# Altium schematic sheet 02_Face_InMain1V0.SchDoc
size A0
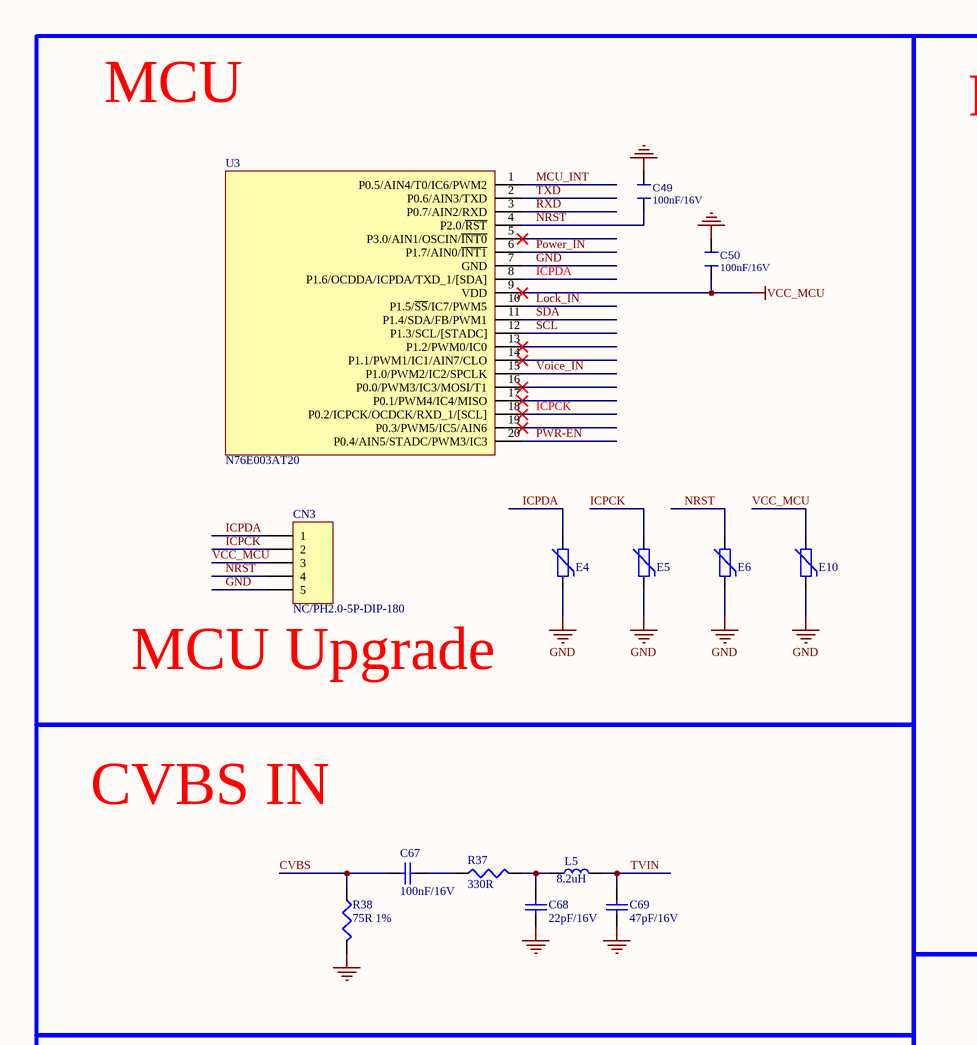
[diagram p0: 02_Face_InMain1V0.SchDoc, top left]
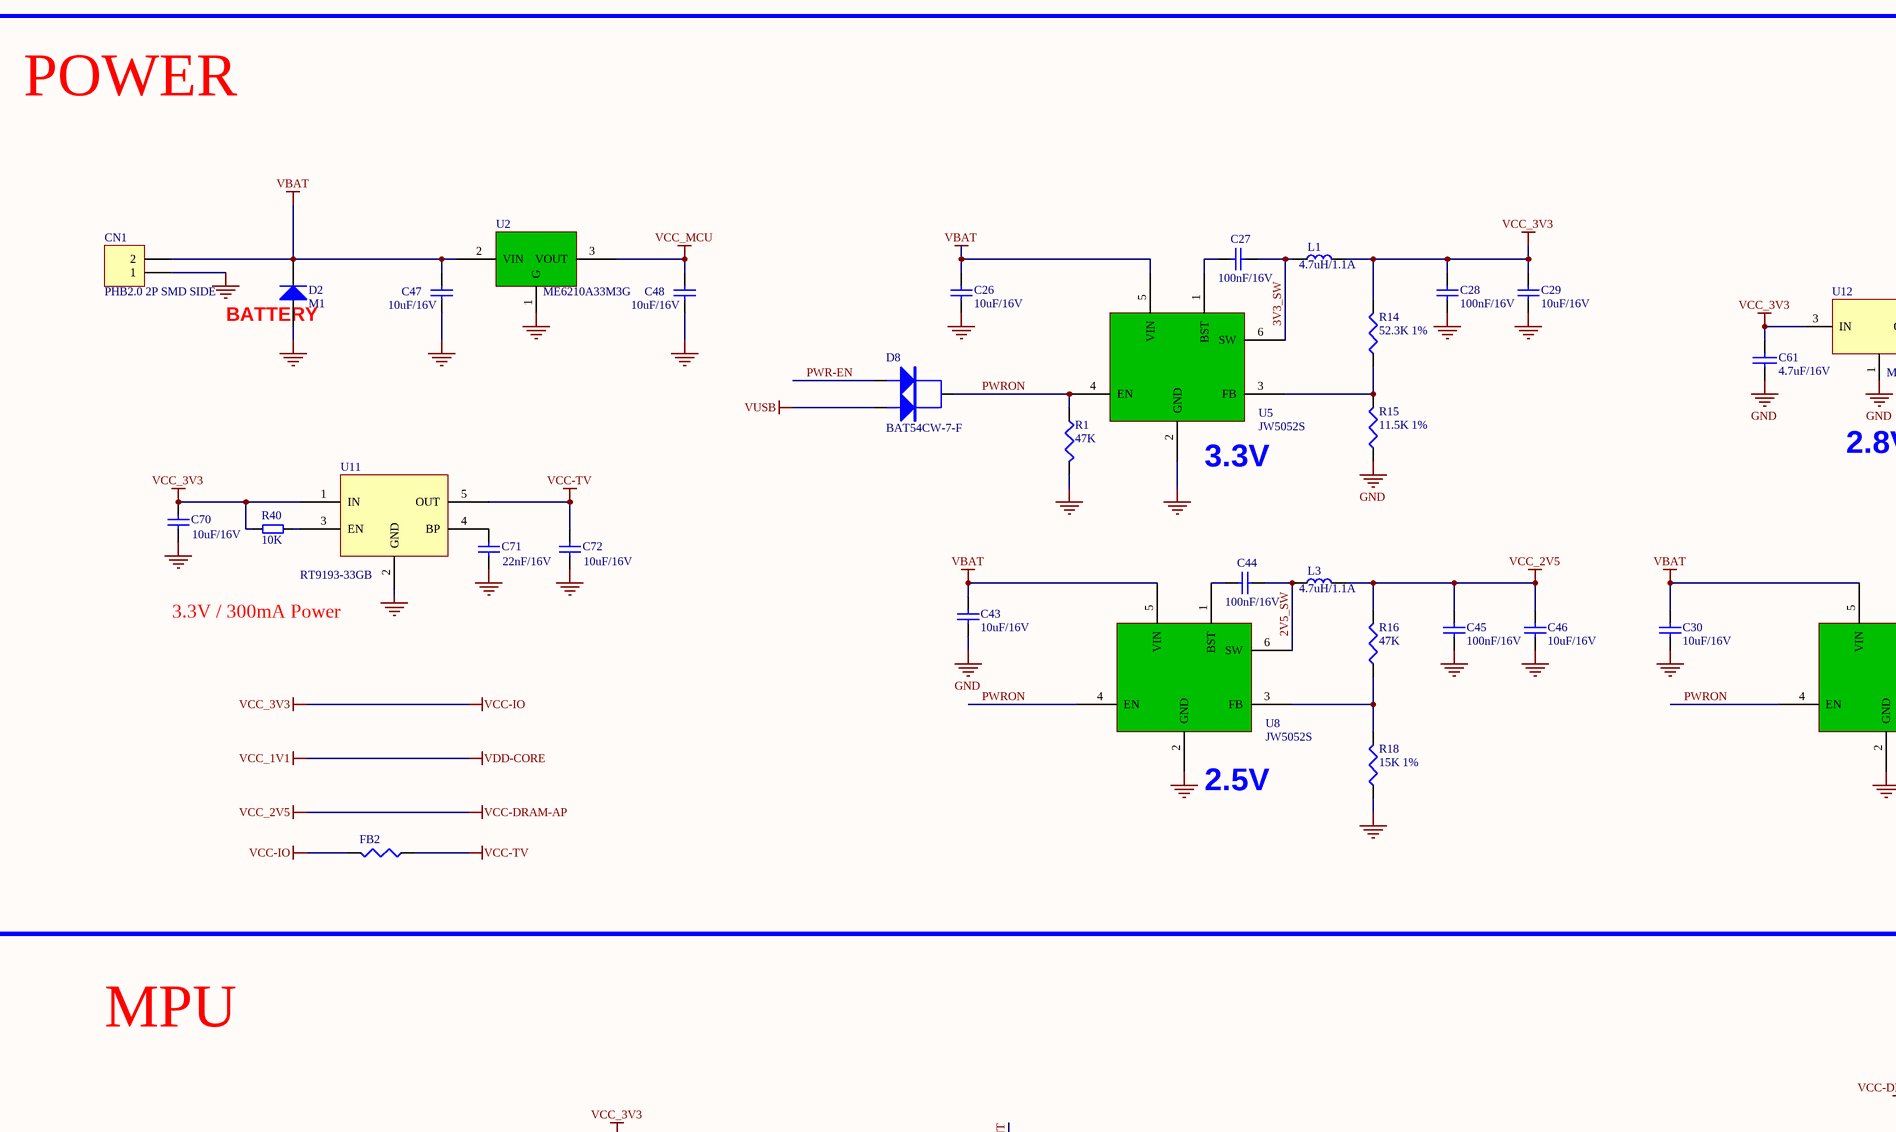
[diagram p1: 02_Face_InMain1V0.SchDoc, top middle]
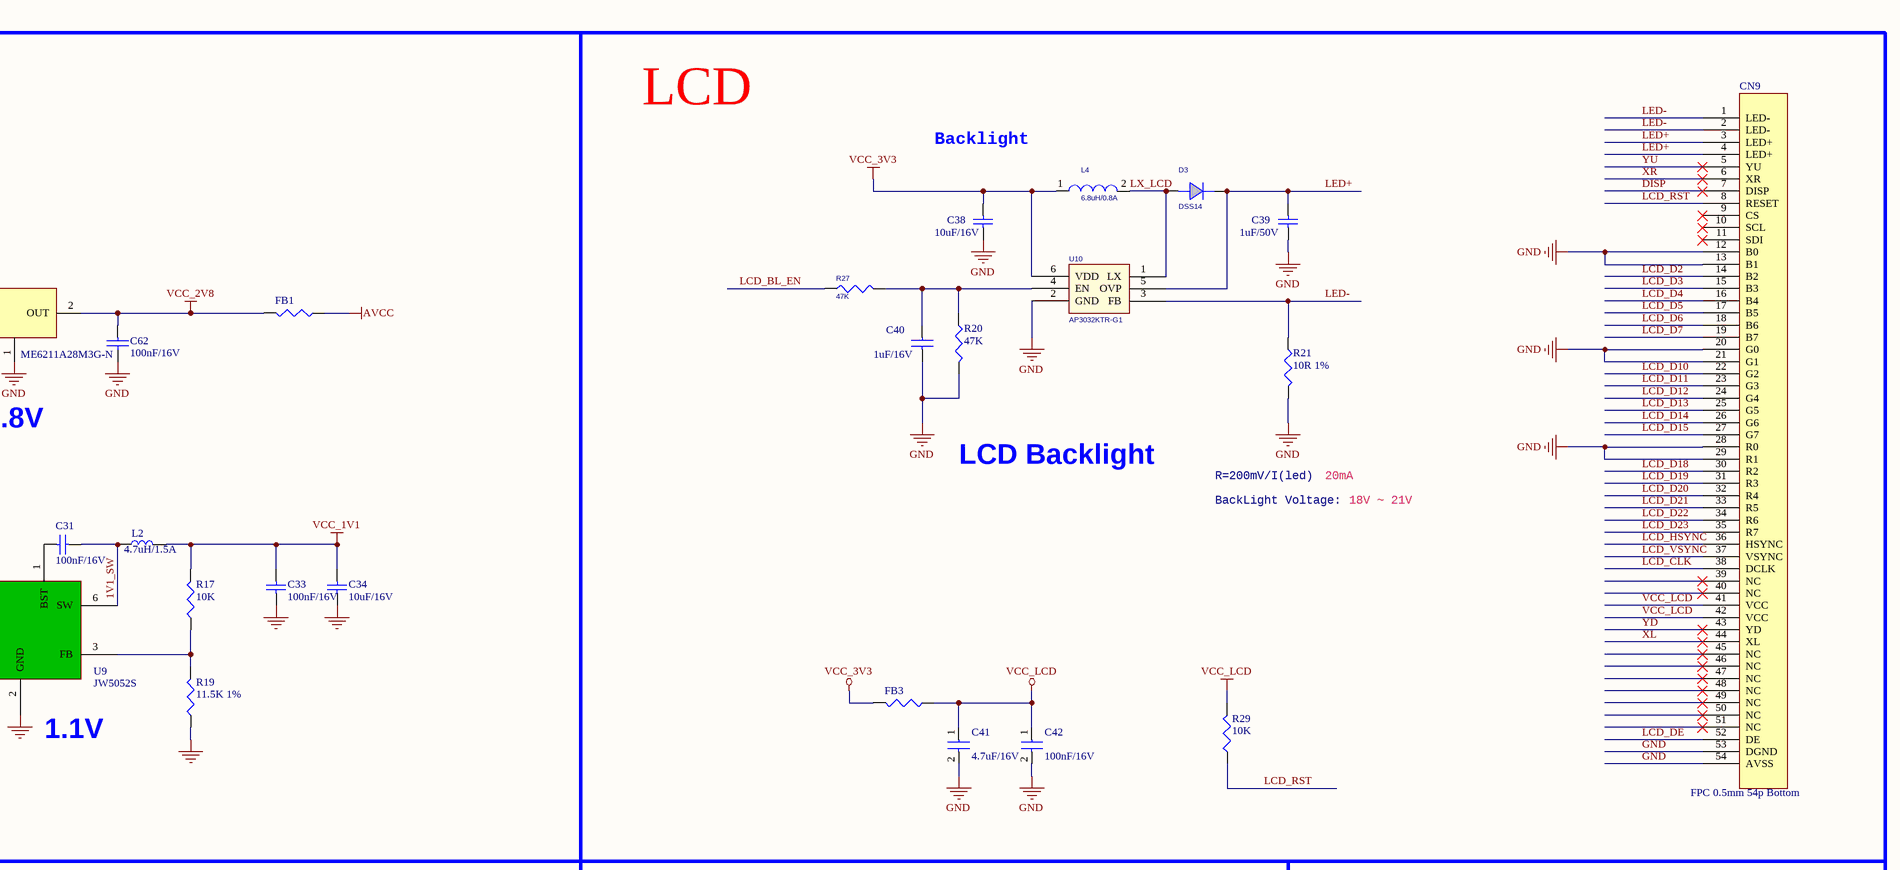
[diagram p2: 02_Face_InMain1V0.SchDoc, top right]
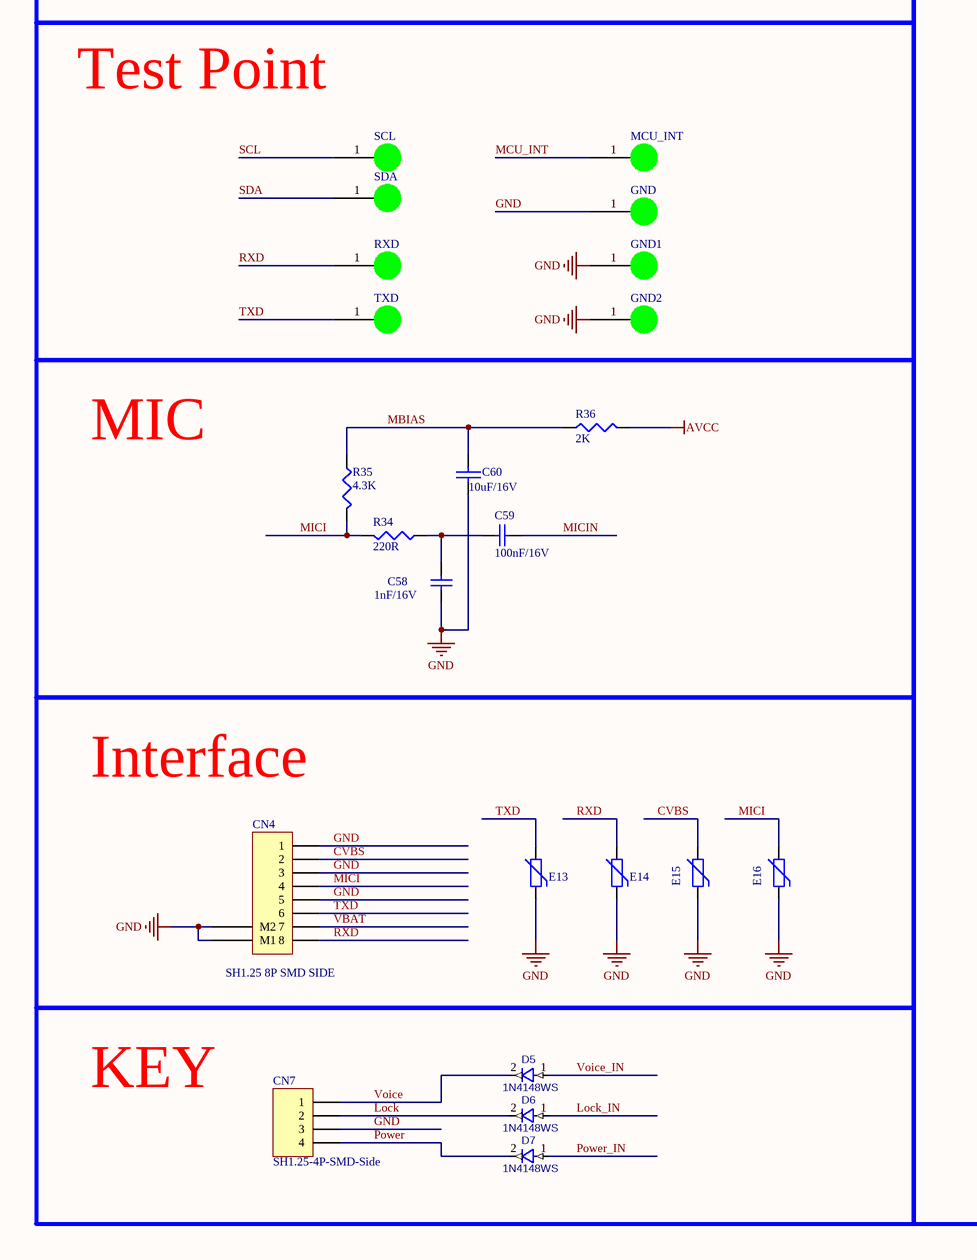
[diagram p3: 02_Face_InMain1V0.SchDoc, bottom left]
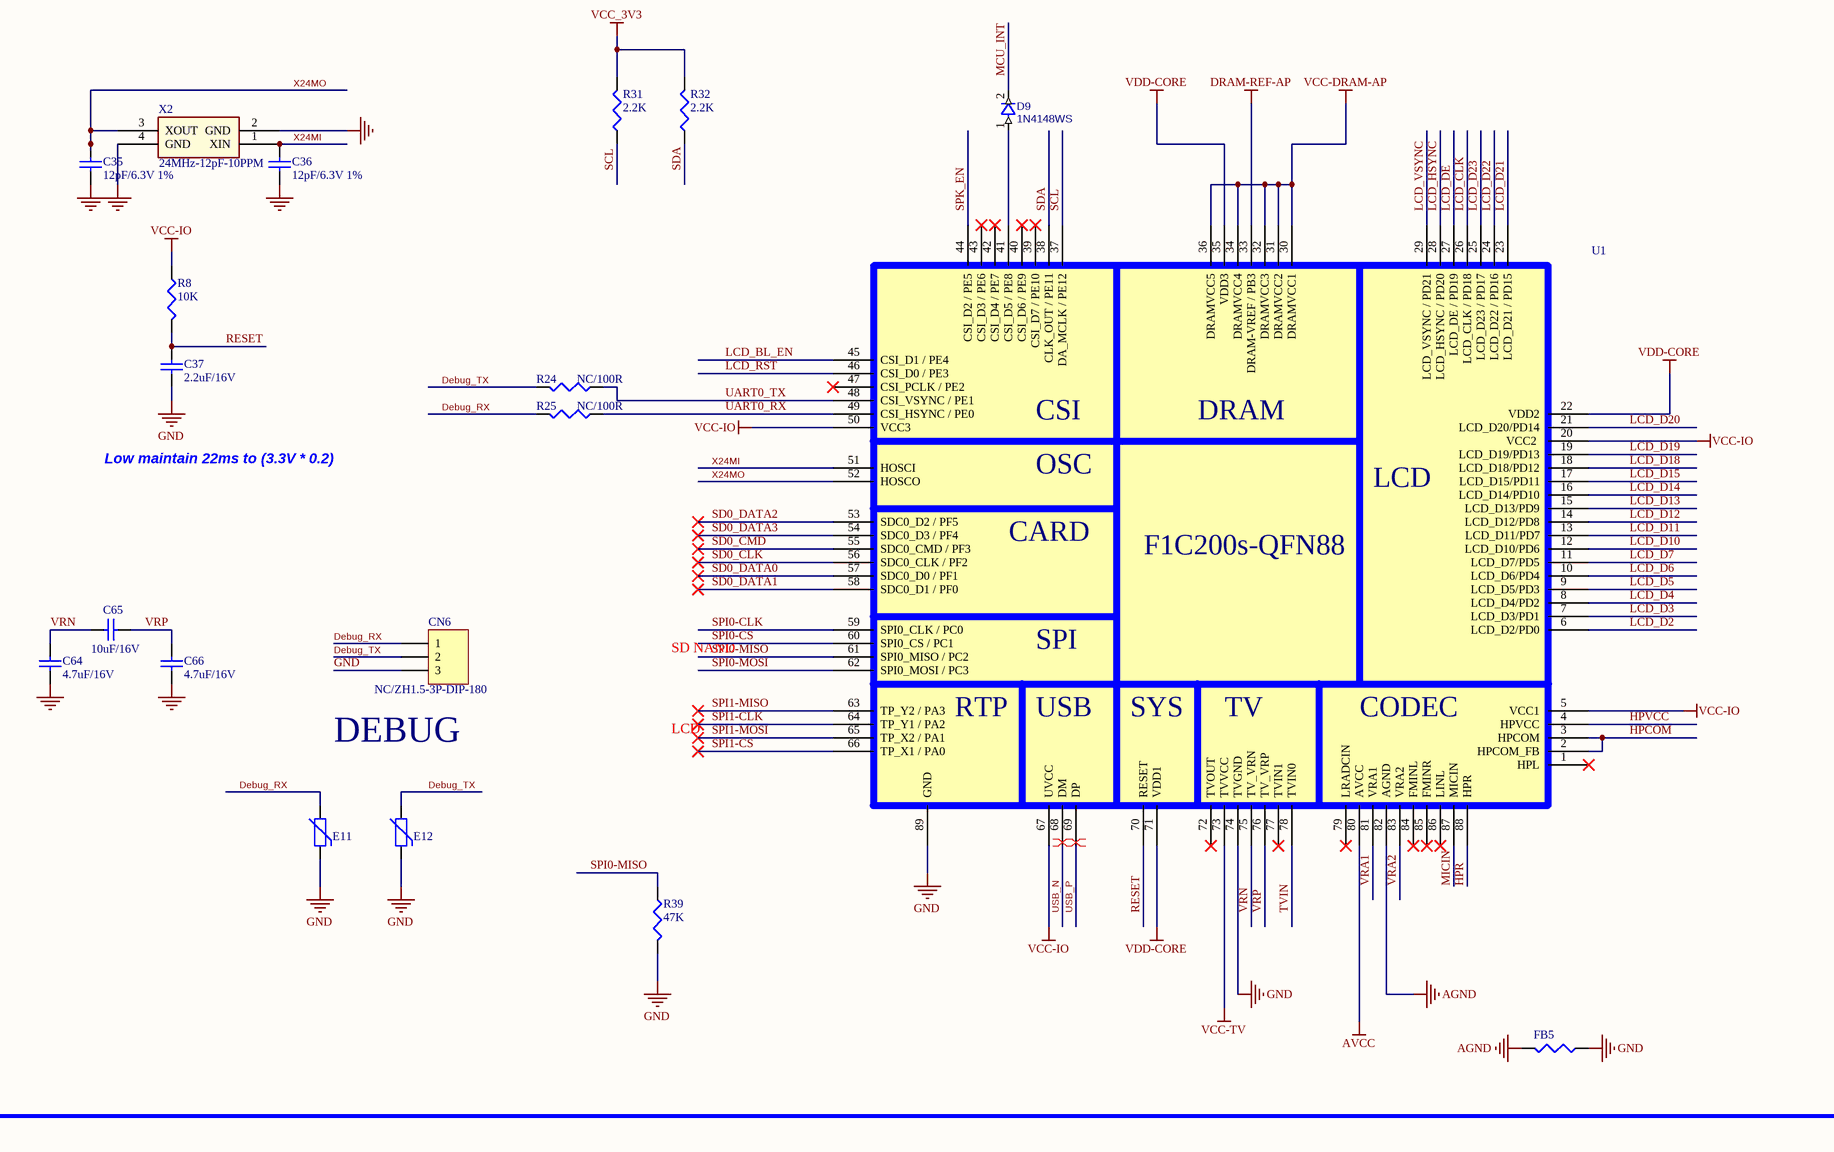
[diagram p4: 02_Face_InMain1V0.SchDoc, bottom middle]
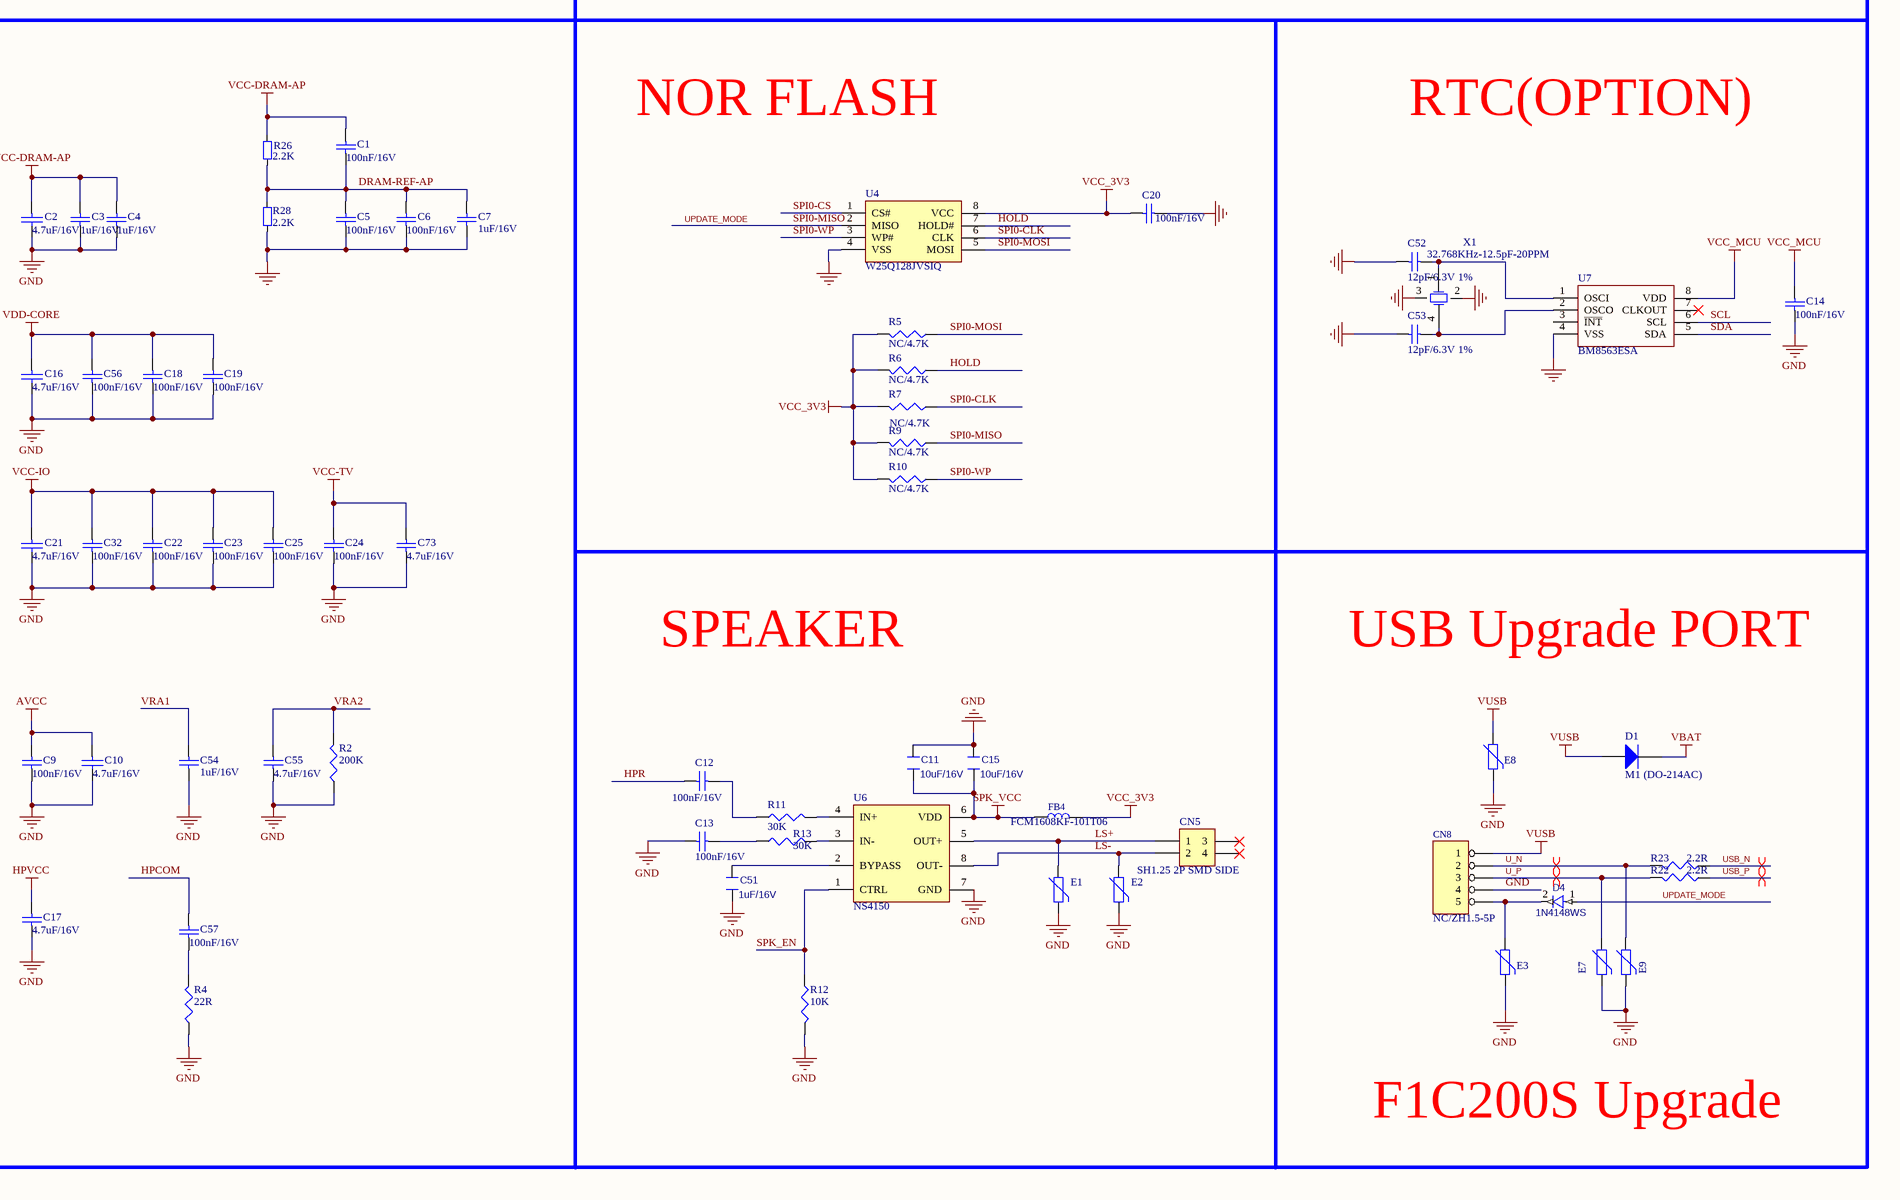
[diagram p5: 02_Face_InMain1V0.SchDoc, bottom right]

## Parts
C1  100nF/16V  [C0402]
C2  4.7uF/16V  [C0603]
C3  1uF/16V  [C0402]
C4  1uF/16V  [C0402]
C5  100nF/16V  [C0402]
C6  100nF/16V  [C0402]
C7  1uF/16V  [C0402]
C9  100nF/16V  [C0402]
C10  4.7uF/16V  [C0603]
C11  10uF/16V  [C0805]
C12  100nF/16V  [C0402]
C13  100nF/16V  [C0402]
C14  100nF/16V  [C0402]
C15  10uF/16V  [C0805]
C16  4.7uF/16V  [C0603]
C17  4.7uF/16V  [C0603]
C18  100nF/16V  [C0402]
C19  100nF/16V  [C0402]
C20  100nF/16V  [C0402]
C21  4.7uF/16V  [C0603]
C22  100nF/16V  [C0402]
C23  100nF/16V  [C0402]
C24  100nF/16V  [C0402]
C25  100nF/16V  [C0402]
C26  10uF/16V  [C0805]
C27  100nF/16V  [C0402]
C28  100nF/16V  [C0402]
C29  10uF/16V  [C0805]
C30  10uF/16V  [C0805]
C31  100nF/16V  [C0402]
C32  100nF/16V  [C0402]
C33  100nF/16V  [C0402]
C34  10uF/16V  [C0805]
C35  12pF/6.3V 1%  [C0402]
C36  12pF/6.3V 1%  [C0402]
C37  2.2uF/16V  [C0402]
C38  10uF/16V  [C0805]
C39  1uF/50V  [C0805]
C40  1uF/16V  [C0402]
C41  4.7uF/16V  [C0603]
C42  100nF/16V  [C0402]
C43  10uF/16V  [C0805]
C44  100nF/16V  [C0402]
C45  100nF/16V  [C0402]
C46  10uF/16V  [C0805]
C47  10uF/16V  [C0805]
C48  10uF/16V  [C0805]
C49  100nF/16V  [C0402]
C50  100nF/16V  [C0402]
C51  1uF/16V  [C0402]
C52  12pF/6.3V 1%  [C0402]
C53  12pF/6.3V 1%  [C0402]
C54  1uF/16V  [C0402]
C55  4.7uF/16V  [C0603]
C56  100nF/16V  [C0402]
C57  100nF/16V  [C0402]
C58  1nF/16V  [C0402]
C59  100nF/16V  [C0402]
C60  10uF/16V  [C0805]
C61  4.7uF/16V  [C0603]
C62  100nF/16V  [C0402]
C64  4.7uF/16V  [C0603]
C65  10uF/16V  [C0805]
C66  4.7uF/16V  [C0603]
C67  100nF/16V  [C0402]
C68  22pF/16V  [C0402]
C69  47pF/16V  [C0402]
C70  10uF/16V  [C0805]
C71  22nF/16V  [C0402]
C72  10uF/16V  [C0805]
C73  4.7uF/16V  [C0603]
CN1  PHB2.0 2P SMD SIDE  [PH2.0_2P_SMD_SIDE]
CN3  NC/PH2.0-5P-DIP-180  [HD2.0_5P]
CN4  SH1.25 8P SMD SIDE  [SH1.25_8P_SMD_SIDE]
CN5  SH1.25 2P SMD SIDE  [SH1.25_2P_SMD_SIDE]
CN6  name1: NC/ZH1.5-3P-DIP-180  [HD1.5_3P]  (hidden comment: NC/ZH1.5 3P)
CN7  name1: SH1.25-4P-SMD-Side  [SH1.25_4P_SMd_SIDE]  (hidden comment: SH1.25-4P-SMD-TOP)
CN8  NC/ZH1.5-5P  [HD5_1.5]
CN9  FPC 0.5mm 54p Bottom  [FPC54_0.5_BOTTOM_Clamshell-1]
D1  M1 (DO-214AC)  [DO-214AC]
D2  M1 (DO-214AC)  [DO-214AC]  (value not drawn)
D3  DSS14  [SOD-123FL]
D4  1N4148WS  [SOD-323]
D5  1N4148WS  [SOD-323]
D6  1N4148WS  [SOD-323]
D7  1N4148WS  [SOD-323]
D8  BAT54CW-7-F (SOT-323)  [sot323]  (value not drawn)
D9  1N4148WS  [SOD-323]
E1  SFI0402-050E330NP-LF  [R0402]  (value not drawn)
E2  SFI0402-050E330NP-LF  [R0402]  (value not drawn)
E3  SFI0402-050E330NP-LF  [R0402]  (value not drawn)
E4  SFI0402-050E330NP-LF  [R0402]  (value not drawn)
E5  SFI0402-050E330NP-LF  [R0402]  (value not drawn)
E6  SFI0402-050E330NP-LF  [R0402]  (value not drawn)
E7  SLESDL0402-24  [R0402]  (value not drawn)
E8  SFI0402-050E330NP-LF  [R0402]  (value not drawn)
E9  SLESDL0402-24  [R0402]  (value not drawn)
E10  SFI0402-050E330NP-LF  [R0402]  (value not drawn)
E11  NC/SFI0402-050E330NP-LF  [R0402]  (value not drawn)
E12  NC/SFI0402-050E330NP-LF  [R0402]  (value not drawn)
E13  SFI0402-050E330NP-LF  [R0402]  (value not drawn)
E14  SFI0402-050E330NP-LF  [R0402]  (value not drawn)
E15  SLESDL0402-24  [R0402]  (value not drawn)
E16  SLESDL0402-24  [R0402]  (value not drawn)
FB1  FB_100R  [R0603]  (value not drawn)
FB2  NC/FB_100R  [R0603]  (value not drawn)
FB3  FB_100R  [R0603]  (value not drawn)
FB4  FCM1608KF-101T06  [R0603]
FB5  FB_100R  [R0603]  (value not drawn)
GND  Test Point  [Test Point]  (value not drawn)
GND1  Test Point  [Test Pad]  (value not drawn)
GND2  Test Point  [Test Pad]  (value not drawn)
L1  4.7uH/1.1A  [CD32]
L2  4.7uH/1.5A  [CD32]
L3  4.7uH/1.1A  [CD32]
L4  6.8uH/0.8A  [CD32]
L5  8.2uH  [R0603]
MCU_INT  Test Point  [Test Point]  (value not drawn)
R1  47K  [R0402]
R2  200K  [R0402]
R4  22R  [R0402]
R5  NC/4.7K  [R0402]
R6  NC/4.7K  [R0402]
R7  NC/4.7K  [R0402]
R8  10K  [R0402]
R9  NC/4.7K  [R0402]
R10  NC/4.7K  [R0402]
R11  30K  [R0402]
R12  10K  [R0402]
R13  30K  [R0402]
R14  52.3K 1%  [R0402]
R15  11.5K 1%  [R0402]
R16  47K  [R0402]
R17  10K  [R0402]
R18  15K 1%  [R0402]
R19  11.5K 1%  [R0402]
R20  47K  [R0402]
R21  10R 1%  [R0603]
R22  2.2R  [R0402]
R23  2.2R  [R0402]
R24  NC/100R  [R0402]
R25  NC/100R  [R0402]
R26  2.2K  [R0402]
R27  47K  [R0402]
R28  2.2K  [R0402]
R29  10K  [R0402]
R31  2.2K  [R0402]
R32  2.2K  [R0402]
R34  220R  [R0402]
R35  4.3K  [R0402]
R36  2K  [R0402]
R37  330R  [R0402]
R38  75R 1%  [R0402]
R39  47K  [R0402]
R40  10K  [R0402]
RXD  Test Point  [Test Point]  (value not drawn)
SCL  Test Point  [Test Point]  (value not drawn)
SDA  Test Point  [Test Point]  (value not drawn)
TXD  Test Point  [Test Point]  (value not drawn)
U1  F1C200s-QFN88  [QFN88 10*10MM]  (value not drawn)
U2  ME6210A33PG (SOT89-3)  [SOT-89]  (value not drawn)
U3  N76E003AT20(TSSOP20)  [SOP20]  (value not drawn)
U4  W25Q128JVSIQ  [SOP8-208mil]
U5  JW5052S  [TSOT23-6]
U6  NS4150  [SOIC8]
U7  BM8563ESA  [SOP8]
U8  JW5052S  [TSOT23-6]
U9  JW5052S  [TSOT23-6]
U10  AP3032KTR-G1  [SOT-23-6]
U11  RT9193-33GB  [SOT-23-5]
U12  ME6211A28M3G-N  [SOT-23-3]
X1  32.768KHz-12.5pF-20PPM  [SMD-7015_4P]
X2  24MHz-12pF-10PPM  [CRY-3225]

## Blocks framed on the sheet
POWER: C26-C31 C33 C34 C43-C48 C61 C62 C70-C72 CN1 D2 D8 FB1 FB2 L1-L3 R1 R14-R19 R40 U2 U5 U8 U9 U11 U12
LCD: C38-C42 CN9 D3 FB3 L4 R20 R21 R27 R29 U10
CVBS IN: C67-C69 L5 R37 R38
MPU: C1-C7 C9 C10 C16-C19 C21-C25 C32 C35-C37 C54-C57 C64-C66 C73 CN6 D9 E11 E12 FB5 R2 R4 R8 R24-R26 R28 R31 R32 R39 U1 X2
NOR FLASH: C20 R5-R7 R9 R10 U4
RTC(OPTION): C14 C52 C53 U7 X1
Test Point: GND GND1 GND2 MCU_INT RXD SCL SDA TXD
MIC: C58-C60 R34-R36
SPEAKER: C11-C13 C15 C51 CN5 E1 E2 FB4 R11-R13 U6
Interface: CN4 E13-E16
KEY: CN7 D5-D7

## Nets
AGND: FB5.2 U1.82(AGND)
AVCC: C9.2 C10.1 FB1.1 R36.2 U1.80(AVCC)
DRAM-REF-AP: C1.1 C5.2 C6.2 C7.2 R26.1 R28.2 U1.33(DRAM-VREF_/_PB3)
GND: C2.2 C3.1 C4.1 C5.1 C6.1 C7.1 C9.1 C10.2 C11.2 C13.2 C14.1 C15.2 C16.2 C17.1 C18.1 C19.1 C20.1 C21.2 C22.1 C23.1 C24.1 C25.1 C26.1 C28.2 C29.1 C30.1 C32.1 C33.2 C34.1 C35.2 C36.1 C37.1 C38.1 C39.1 C40.2 C41.2 C42.2 C43.1 C45.2 C46.1 C47.1 C48.1 C49.2 C50.1 C51.2 C52.2 C53.2 C54.1 C55.1 C56.1 C58.2 C60.2 C61.2 C62.2 C64.1 C66.1 C68.2 C69.2 C70.1 C71.1 C72.1 C73.1 CN1.1 CN3.5 CN4.1 CN4.3 CN4.5 CN4.M1 CN4.M2 CN6.3 CN7.3 CN8.4 CN9.12(B0) CN9.13(B1) CN9.20(G0) CN9.21(G1) CN9.28(R0) CN9.29(R1) CN9.53(DGND) CN9.54(AVSS) D2.1(A) E1.2 E2.2 E3.2 E4.2 E5.2 E6.2 E7.2 E8.2 E9.2 E10.2 E11.2 E12.2 E13.2 E14.2 E15.2 E16.2 FB5.1 GND.1 GND1.1 GND2.1 R1.2 R2.1 R4.1 R12.2 R15.1 R18.1 R19.1 R20.2 R21.2 R28.1 R38.2 R39.2 U1.74(TVGND) U1.89(GND) U2.1(G) U3.7(GND) U4.4(VSS) U5.2(GND) U6.7(GND) U7.4(VSS) U8.2(GND) U9.2(GND) U10.2(GND) U11.2(GND) U12.1 X1.2(GND) X1.3(GND) X2.2(GND) X2.4(GND)
HPVCC: C17.2 U1.4(HPVCC)
SPK_VCC: C11.1 C15.1 FB4.1 U6.6(VDD)
VBAT: C26.2 C30.2 C43.2 C47.2 CN1.2 CN4.7 D1.2(K) D2.2(K) U2.2(VIN) U5.5(VIN) U8.5(VIN) U9.5(VIN)
VCC-DRAM-AP: C1.2 C2.1 C3.2 C4.2 C45.1 C46.2 L3.2 R16.2 R26.2 U1.30(DRAMVCC1) U1.31(DRAMVCC2) U1.32(DRAMVCC3) U1.34(DRAMVCC4) U1.36(DRAMVCC5)  [also labelled VCC_2V5]
VCC-IO: C20.2 C21.1 C22.2 C23.2 C25.2 C28.1 C29.2 C32.2 C38.2 C61.1 C70.2 FB2.2 FB3.2 FB4.2 L1.2 L4.1 R5.2 R6.2 R7.2 R8.1 R9.2 R10.2 R14.2 R31.2 R32.2 R40.2 U1.5(VCC1) U1.20(VCC2) U1.50(VCC3) U1.67(UVCC) U4.8(VCC) U10.6(VDD) U11.1(IN) U12.3(IN)  [also labelled VCC_3V3]
VCC-TV: C24.2 C72.2 C73.2 FB2.1 U1.73(TVVCC) U11.5(OUT)
VCC_1V1: C16.1 C18.2 C19.2 C33.1 C34.2 C56.2 L2.2 R17.2 U1.22(VDD2) U1.35(VDD3) U1.71(VDD1)  [also labelled VDD-CORE]
VCC_2V8: C62.1 FB1.2 U12.2(OUT)
VCC_LCD: C41.1 C42.1 CN9.41(VCC) CN9.42(VCC) FB3.1 R29.2
VCC_MCU: C14.2 C48.2 C50.2 CN3.3 E10.1 U2.3(VOUT) U3.9(VDD) U7.8(VDD)
VUSB: CN8.1 D1.1(A) D8.1(1A) E8.1
1V1_SW: C31.2 L2.1 U9.6(SW)
2V5_SW: C44.1 L3.1 U8.6(SW)
3V3_SW: C27.1 L1.1 U5.6(SW)
CVBS: C67.2 CN4.2 E15.1 R38.1
Debug_RX: CN6.1 E11.1 R25.2
Debug_TX: CN6.2 E12.1 R24.2
DISP: CN9.7(DISP)
HOLD: R6.1 U4.7(HOLD#)
HPCOM: C57.2 U1.2(HPCOM_FB) U1.3(HPCOM)
HPR: C12.2 U1.88(HPR)
ICPCK: CN3.2 E5.1 U3.18(P0.2/ICPCK/OCDCK/RXD_1/[SCL])
ICPDA: CN3.1 E4.1 U3.8(P1.6/OCDDA/ICPDA/TXD_1/[SDA])
LCD_BL_EN: R27.1 U1.45(CSI_D1_/_PE4)
LCD_CLK: CN9.38(DCLK) U1.26(LCD_CLK_/_PD18)
LCD_D2: CN9.14(B2) U1.6(LCD_D2/PD0)
LCD_D3: CN9.15(B3) U1.7(LCD_D3/PD1)
LCD_D4: CN9.16(B4) U1.8(LCD_D4/PD2)
LCD_D5: CN9.17(B5) U1.9(LCD_D5/PD3)
LCD_D6: CN9.18(B6) U1.10(LCD_D6/PD4)
LCD_D7: CN9.19(B7) U1.11(LCD_D7/PD5)
LCD_D10: CN9.22(G2) U1.12(LCD_D10/PD6)
LCD_D11: CN9.23(G3) U1.13(LCD_D11/PD7)
LCD_D12: CN9.24(G4) U1.14(LCD_D12/PD8)
LCD_D13: CN9.25(G5) U1.15(LCD_D13/PD9)
LCD_D14: CN9.26(G6) U1.16(LCD_D14/PD10)
LCD_D15: CN9.27(G7) U1.17(LCD_D15/PD11)
LCD_D18: CN9.30(R2) U1.18(LCD_D18/PD12)
LCD_D19: CN9.31(R3) U1.19(LCD_D19/PD13)
LCD_D20: CN9.32(R4) U1.21(LCD_D20/PD14)
LCD_D21: CN9.33(R5) U1.23(LCD_D21_/_PD15)
LCD_D22: CN9.34(R6) U1.24(LCD_D22_/_PD16)
LCD_D23: CN9.35(R7) U1.25(LCD_D23_/_PD17)
LCD_DE: CN9.52(DE) U1.27(LCD_DE_/_PD19)
LCD_HSYNC: CN9.36(HSYNC) U1.28(LCD_HSYNC_/_PD20)
LCD_RST: CN9.8(RESET) R29.1 U1.46(CSI_D0_/_PE3)
LCD_VSYNC: CN9.37(VSYNC) U1.29(LCD_VSYNC_/_PD21)
LED+: C39.2 CN9.3(LED+) CN9.4(LED+) D3.2 U10.5(OVP)
LED-: CN9.1(LED-) CN9.2(LED-) R21.1 U10.3(FB)
Lock: CN7.2 D6.2(K)
Lock_IN: D6.1(A) U3.10(P1.5/~{SS}/IC7/PWM5)
LS+: CN5.1 E1.1 U6.5(OUT+)
LS-: CN5.2 E2.1 U6.8(OUT-)
LX_LCD: D3.1 L4.2 U10.1(LX)
MBIAS: C60.1 R35.1 R36.1
MCU_INT: D9.2(K) MCU_INT.1 U3.1(P0.5/AIN4/T0/IC6/PWM2)
MICI: CN4.4 E16.1 R34.2 R35.2
MICIN: C59.1 U1.87(MICIN)
NRST: C49.1 CN3.4 E6.1 U3.4(P2.0/~{RST})
Power: CN7.4 D7.2(K)
Power_IN: D7.1(A) U3.6(P1.7/AIN0/~{INT1})
PWR-EN: D8.2(2A) U3.20(P0.4/AIN5/STADC/PWM3/IC3)
PWRON: D8.3(K) R1.1 U5.4(EN) U8.4(EN) U9.4(EN)
RESET: C37.2 R8.2 U1.70(RESET)
RXD: CN4.8 E14.1 RXD.1 U3.3(P0.7/AIN2/RXD)
SCL: R31.1 SCL.1 U1.37(DA_MCLK_/_PE12) U3.12(P1.3/SCL/[STADC]) U7.6(SCL)
SD0_CLK: U1.56(SDC0_CLK_/_PF2)
SD0_CMD: U1.55(SDC0_CMD_/_PF3)
SD0_DATA0: U1.57(SDC0_D0_/_PF1)
SD0_DATA1: U1.58(SDC0_D1_/_PF0)
SD0_DATA2: U1.53(SDC0_D2_/_PF5)
SD0_DATA3: U1.54(SDC0_D3_/_PF4)
SDA: R32.1 SDA.1 U1.38(CLK_OUT_/_PE11) U3.11(P1.4/SDA/FB/PWM1) U7.5(SDA)
SPI0-CLK: R7.1 U1.59(SPI0_CLK_/_PC0) U4.6(CLK)
SPI0-CS: U1.60(SPI0_CS_/_PC1) U4.1(CS#)
SPI0-MISO: D4.1(A) R9.1 R39.1 U1.61(SPI0_MISO_/_PC2) U4.2(MISO)  [also labelled UPDATE_MODE]
SPI0-MOSI: R5.1 U1.62(SPI0_MOSI_/_PC3) U4.5(MOSI)
SPI0-WP: R10.1 U4.3(WP#)
SPI1-CLK: U1.64(TP_Y1_/_PA2)
SPI1-CS: U1.66(TP_X1_/_PA0)
SPI1-MISO: U1.63(TP_Y2_/_PA3)
SPI1-MOSI: U1.65(TP_X2_/_PA1)
SPK_EN: R12.1 U1.44(CSI_D2_/_PE5) U6.1(CTRL)
TVIN: C69.1 L5.2 U1.78(TVIN0)
TXD: CN4.6 E13.1 TXD.1 U3.2(P0.6/AIN3/TXD)
U_N: CN8.2 E9.1 R23.2
U_P: CN8.3 E7.1 R22.2
UART0_RX: R25.1 U1.49(CSI_HSYNC_/_PE0)
UART0_TX: R24.1 U1.48(CSI_VSYNC_/_PE1)
USB_N: R23.1 U1.68(DM)
USB_P: R22.1 U1.69(DP)
Voice: CN7.1 D5.2(K)
Voice_IN: D5.1(A) U3.15(P1.0/PWM2/IC2/SPCLK)
VRA1: C54.2 U1.81(VRA1)
VRA2: C55.2 R2.2 U1.83(VRA2)
VRN: C64.2 C65.2 U1.75(TV_VRN)
VRP: C65.1 C66.2 U1.76(TV_VRP)
X24MI: C36.2 U1.51(HOSCI) X2.1(XIN)
X24MO: C35.1 U1.52(HOSCO) X2.3(XOUT)
XL: CN9.44(XL)
XR: CN9.6(XR)
YD: CN9.43(YD)
YU: CN9.5(YU)
NetC12_1: C12.1 R11.1
NetC13_1: C13.1 R13.1
NetC27_2: C27.2 U5.1(BST)
NetC31_1: C31.1 U9.1(BST)
NetC40_1: C40.1 R20.1 R27.2 U10.4(EN)
NetC44_2: C44.2 U8.1(BST)
NetC51_1: C51.1 U6.2(BYPASS)
NetC52_1: C52.1 U7.1(OSCI) X1.1(OSC1)
NetC53_1: C53.1 U7.2(OSCO) X1.4(OSC2)
NetC57_1: C57.1 R4.2
NetC58_1: C58.1 C59.2 R34.1
NetC67_1: C67.1 R37.1
NetC68_1: C68.1 L5.1 R37.2
NetC71_2: C71.2 U11.4(BP)
NetCN8_5: CN8.5 D4.2(K) E3.1
NetD9_1: D9.1(A) U1.41(CSI_D5_/_PE8)
NetR11_2: R11.2 U6.4(IN+)
NetR13_2: R13.2 U6.3(IN-)
NetR14_1: R14.1 R15.2 U5.3(FB)
NetR16_1: R16.1 R18.2 U8.3(FB)
NetR17_1: R17.1 R19.2 U9.3(FB)
NetR40_1: R40.1 U11.3(EN)

Not connected (* = marked no-connect by the designer): CN5 3* 4*; CN9 9(CS)* 10(SCL)* 11(SDI)* 39(NC)* 40(NC)* 45(NC)* 46(NC)* 47(NC)* 48(NC)* 49(NC)* 50(NC)* 51(NC)*; U1 1(HPL)* 39(CSI_D7_/_PE10)* 40(CSI_D6_/_PE9)* 42(CSI_D4_/_PE7)* 43(CSI_D3_/_PE6)* 47(CSI_PCLK_/_PE2)* 72(TVOUT)* 77(TVIN1)* 79(LRADCIN)* 84(FMINL)* 85(FMINR)* 86(LINL)*; U3 5(P3.0/AIN1/OSCIN/~{INT0})* 13(P1.2/PWM0/IC0)* 14(P1.1/PWM1/IC1/AIN7/CLO)* 16(P0.0/PWM3/IC3/MOSI/T1)* 17(P0.1/PWM4/IC4/MISO)* 19(P0.3/PWM5/IC5/AIN6)*; U7 3(~{INT}) 7(CLKOUT)*

## Layout directives
differential pair; differential pair class 90ohm: USB_N, USB_P
differential pair: U_N, U_P, USB_N, USB_P

## Notes on the sheet
- MCU
- Backlight
- (near CN1) BATTERY
- (near U5) 3.3V
- 2.8V
- LCD Backlight
- R=200mV/I(led)
- BackLight Voltage:
- 20mA
- 18V ~ 21V
- 3.3V / 300mA Power
- (near CN3) MCU Upgrade
- (near U8) 2.5V
- (near U9) 1.1V
- Low maintain 22ms to (3.3V * 0.2)
- USB Upgrade PORT
- SD NAND
- LCD
- (near CN6) DEBUG
- F1C200S Upgrade
- Title
- Size:
- Date:
- File:
- A0
- Number:
- Time:
- Revision:
- Sheet
- of
- (in symbol BAT54CW-KL7) BAT54CW-7-F
- (in symbol F1C200S) CSI; DRAM; OSC; LCD; CARD; SPI; RTP; USB; SYS; TV; CODEC
- (in symbol HT7333) ME6210A33M3G
- (in symbol M2 (DO-214AC)) M1

## Library data of the parts
C1 C12-C14 C18-C20 C22-C25 = Cap: 0.1uF  ±10% 16V X7R 0402 ROSH; Value: 100pF; Published: 8-Jun-2000; LatestRevisionDate: 17-Jul-2002; LatestRevisionNote: Re-released for DXP Platform.; PackageReference: RAD-0.3; Publisher: Altium Limited; PackageDescription: Radial Cap, Thru-Hole; 2 Leads; 0.3 in Pin Spacing
C2 C10 C16 C21 C61 = CAP: 4.7uF/16V 10% 0603 X7R ROHS
C3 C4 C7 C54 = Cap: 1uF/16V 10%  0402 X7R ROHS; Value: 100pF; Published: 8-Jun-2000; LatestRevisionDate: 17-Jul-2002; LatestRevisionNote: Re-released for DXP Platform.; PackageReference: RAD-0.3; Publisher: Altium Limited; PackageDescription: Radial Cap, Thru-Hole; 2 Leads; 0.3 in Pin Spacing
C5 C6 C9 C27 C28 C31-C33 C44 C45 C56 C57 C59 = Cap: 0.1uF  ±10% 16V X7R 0402 ROHS; Value: 100pF; Published: 8-Jun-2000; LatestRevisionDate: 17-Jul-2002; LatestRevisionNote: Re-released for DXP Platform.; PackageReference: RAD-0.3; Publisher: Altium Limited; PackageDescription: Radial Cap, Thru-Hole; 2 Leads; 0.3 in Pin Spacing
C11 C15 = CAP: 10uF/16V 10% 0805 X7R ROHS; 名称: 贴片电容
C17 C55 C64 C66 C73 = Cap: 4.7uF/16V 10% 0603 X7R ROHS; Value: 100pF; Published: 8-Jun-2000; LatestRevisionDate: 17-Jul-2002; LatestRevisionNote: Re-released for DXP Platform.; PackageReference: RAD-0.3; Publisher: Altium Limited; PackageDescription: Radial Cap, Thru-Hole; 2 Leads; 0.3 in Pin Spacing
C26 C29 C30 C34 C38 C43 C46-C48 C65 C70 C72 = Cap: 10uF/16V 10% 0805 X7R ROHS; Value: 100pF; Published: 8-Jun-2000; LatestRevisionDate: 17-Jul-2002; LatestRevisionNote: Re-released for DXP Platform.; PackageReference: RAD-0.3; Publisher: Altium Limited; PackageDescription: Radial Cap, Thru-Hole; 2 Leads; 0.3 in Pin Spacing
C35 C36 C52 C53 = Cap: 12pF/6.3V 2% 0402 NPO ROHS; Value: 100pF; Published: 8-Jun-2000; LatestRevisionDate: 17-Jul-2002; LatestRevisionNote: Re-released for DXP Platform.; PackageReference: RAD-0.3; Publisher: Altium Limited; PackageDescription: Radial Cap, Thru-Hole; 2 Leads; 0.3 in Pin Spacing
C37 = Cap: 2.2uF/16V 10%  0402 X7R ROHS; Value: 100pF; Published: 8-Jun-2000; LatestRevisionDate: 17-Jul-2002; LatestRevisionNote: Re-released for DXP Platform.; PackageReference: RAD-0.3; Publisher: Altium Limited; PackageDescription: Radial Cap, Thru-Hole; 2 Leads; 0.3 in Pin Spacing
C39 = Cap: 1uF/50V 10% 0805 X7R ROHS; Value: 100pF; Published: 8-Jun-2000; LatestRevisionDate: 17-Jul-2002; LatestRevisionNote: Re-released for DXP Platform.; PackageReference: RAD-0.3; Publisher: Altium Limited; PackageDescription: Radial Cap, Thru-Hole; 2 Leads; 0.3 in Pin Spacing
C40 = CAP NP_Dup1: 1uF/16V 10%  0402 X7R ROHS; Manufacturer: TDK; Dielectric: X5R; Voltage: 6.3V; Number: 37; RK PN: C1005X5R0J104K050BA; Priority: A; Part Type: C0402; Tolerance: 10%; Manufacturer PN: C1005X5R0J104K050BA; C_Voltage: 6.3V; Created by: JJJ
C41 = CAP NP_Dup1: 4.7uF/16V 10% 0603 X7R ROHS; Manufacturer: TDK; Dielectric: X5R; Voltage: 6.3V; Number: 37; RK PN: C1005X5R0J104K050BA; Priority: A; Part Type: C0402; Tolerance: 10%; Manufacturer PN: C1005X5R0J104K050BA; C_Voltage: 6.3V; Created by: JJJ
C42 = CAP NP_Dup1: 0.1uF  ±10% 16V X7R 0402 ROHS; Manufacturer: TDK; Dielectric: X5R; Voltage: 6.3V; Number: 37; RK PN: C1005X5R0J104K050BA; Priority: A; Part Type: C0402; Tolerance: 10%; Manufacturer PN: C1005X5R0J104K050BA; C_Voltage: 6.3V; Created by: JJJ
C49 C50 = CAP: 0.1uF  ±10% 16V X7R 0402 ROHS; 名称: 贴片电容
C51 = CAP: 1uF ±10% 16V X7R 0402 ROSH; 名称: 贴片电容
C58 = Cap: 1nF  ±10% 16V X7R 0402 ROHS; Value: 100pF; Published: 8-Jun-2000; LatestRevisionDate: 17-Jul-2002; LatestRevisionNote: Re-released for DXP Platform.; PackageReference: RAD-0.3; Publisher: Altium Limited; PackageDescription: Radial Cap, Thru-Hole; 2 Leads; 0.3 in Pin Spacing
C60 = CAP: 10uF/16V 10% 0805 X7R ROHS
C62 = CAP: 100nF/16V 10% 0402 X7R ROHS
C67 = Cap: 100nF/16V 10% 0402 X7R ROHS; Value: 100pF; Published: 8-Jun-2000; LatestRevisionDate: 17-Jul-2002; LatestRevisionNote: Re-released for DXP Platform.; PackageReference: RAD-0.3; Publisher: Altium Limited; PackageDescription: Radial Cap, Thru-Hole; 2 Leads; 0.3 in Pin Spacing
C68 = Cap: 22pF/16V 10% 0402 X7R ROHS; Value: 100pF; Published: 8-Jun-2000; LatestRevisionDate: 17-Jul-2002; LatestRevisionNote: Re-released for DXP Platform.; PackageReference: RAD-0.3; Publisher: Altium Limited; PackageDescription: Radial Cap, Thru-Hole; 2 Leads; 0.3 in Pin Spacing
C69 = Cap: 47pF/16V 10% 0402 X7R ROHS; Value: 100pF; Published: 8-Jun-2000; LatestRevisionDate: 17-Jul-2002; LatestRevisionNote: Re-released for DXP Platform.; PackageReference: RAD-0.3; Publisher: Altium Limited; PackageDescription: Radial Cap, Thru-Hole; 2 Leads; 0.3 in Pin Spacing
C71 = Cap: 22nF/16V 10% 0402 X7R ROHS; Value: 100pF; Published: 8-Jun-2000; LatestRevisionDate: 17-Jul-2002; LatestRevisionNote: Re-released for DXP Platform.; PackageReference: RAD-0.3; Publisher: Altium Limited; PackageDescription: Radial Cap, Thru-Hole; 2 Leads; 0.3 in Pin Spacing
CN1 = Header 2: PHB2.0 2P 90; LatestRevisionDate: 17-Jul-2002; LatestRevisionNote: Re-released for DXP Platform.; Publisher: Altium Limited
CN3 = Header5: PH2.0-5P-DIP-180; 物料编号: ECZ02035; 名称: 弯针插座; 规格，型号: PH 2Pin 间距2.0mm DIP/90°; Parameter 1: PH2.0-5P-SMD-Top; Parameter 2: PH2.0-5P-SMD-Side; name1: NC/PH2.0-5P-DIP-180
CN4 = Header 8: FPC8_0.5; LatestRevisionDate: 17-Jul-2002; LatestRevisionNote: Re-released for DXP Platform.; Publisher: Altium Limited
CN5 = Header2: 物料编号: ECZ02035; 名称: 弯针插座; 规格，型号: PH 2Pin 间距2.0mm DIP/90°; name1: PH2.0-2P-DIP-180; Parameter 1: SH1.25-2P-SMD-Top; Parameter 2: PH2.0-2P-SMD-Side
CN6 = Header3: ZH1.5mm 3P; 物料编号: ECZ02035; 名称: 弯针插座; 规格，型号: PH 2Pin 间距2.0mm DIP/90°; Parameter 1: PH2.0-3P-SMD-Top; Parameter 2: PH2.0-3P-SMD-Side
CN7 = Header4: 物料编号: ECZ02035; 名称: 弯针插座; 规格，型号: PH 2Pin 间距2.0mm DIP/90°; Parameter 1: PH2.0-4P-SMD-Top; Parameter 2: PH2.0-4P-SMD-Side
CN8 = HEADER 5: ZH1.5mm 5P
CN9 = CON54
D1 = M2 (DO-214AC): 物料编号: EEJ00001; 名称: 贴片二极管; 规格，型号: SS34 (DO-214AC)
D2 = M2 (DO-214AC)
D3 = D_0: Allegro PCB Footprint: d2513A
D4-D7 D9 = 1N4500: 1N4148WS (SOD-323)
D8 = BAT54CW-KL7: 物料编号: EEJ00007; 名称: 贴片二极管; 规格，型号: BAT54CW-KL7 (SOT323)
E1-E10 E13-E16 = VARISTOR
  E1 E2: Parameter 1: SFI0402
E11 E12 = VARISTOR: SFI0402-050E330NP-LF
FB1-FB3 FB5 = RESISTOR_Dup1: FCM1608KF-101T06; Manufacturer: YAGEO; Tolerance: 5%; RK PN: RC0402JR-0722RL; Priority: A; Wattage: 1/16W; Part Type: Í¨ÓÃºñÄ¤µç×è; Manufacturer PN: RC0402JR-0722RL; Created by: YTL
FB4 = INDUCTOR: 名称: 贴片电感; 规格，型号: 1uH; Parameter 1: SWPA3012S4R7MT(4.7UH@1.24A DCR<0.12R); Parameter 2: SWPA4018S4R7MT(4.7UH@1.2A DCR<0.1R); Parameter 3: SWPA4020S2R2NT(2.2UH@1.85A DCR<0.1R); Parameter 4: SWPA4030S4R7MT(4.7UH@1.2A DCR<0.1R)
L1-L3 = Inductor: SWPA3015S4R7MT(4.7uH@1.1A DCR<0.125R)
L4 = INDUCTOR_Dup1: SWPA3015S6R8MT(6.8uH@0.85A DCR<0.200R)
L5 = Inductor: SDFL1608S8R2KTF(8.2uH@5mA DCR<2.1R)
R1 R16 R20 R39 = RESISTOR_Dup1: 47K +/-1% 1/16W 0402 ROHS; Manufacturer: YAGEO; Tolerance: 5%; RK PN: RC0402JR-0722RL; Priority: A; Part Type: Í¨ÓÃºñÄ¤µç×è; Wattage: 1/16W; Manufacturer PN: RC0402JR-0722RL; Created by: YTL
R2 = RESISTOR_Dup1: 200K +/-5% 1/16W 0402 ROHS; Manufacturer: YAGEO; Tolerance: 5%; RK PN: RC0402JR-0722RL; Priority: A; Part Type: Í¨ÓÃºñÄ¤µç×è; Wattage: 1/16W; Manufacturer PN: RC0402JR-0722RL; Created by: YTL
R4 = RESISTOR_Dup1: 22R +/-5% 1/16W 0402 ROHS; Manufacturer: YAGEO; Tolerance: 5%; RK PN: RC0402JR-0722RL; Priority: A; Part Type: Í¨ÓÃºñÄ¤µç×è; Wattage: 1/16W; Manufacturer PN: RC0402JR-0722RL; Created by: YTL
R5-R7 R9 R10 = RESISTOR_Dup1: 4.7K +/-5% 1/16W 0402 ROHS; Manufacturer: YAGEO; Tolerance: 5%; RK PN: RC0402JR-0722RL; Priority: A; Part Type: Í¨ÓÃºñÄ¤µç×è; Wattage: 1/16W; Manufacturer PN: RC0402JR-0722RL; Created by: YTL
R8 R12 R17 R29 = RESISTOR_Dup1: 10K +/-1% 1/16W 0402 ROHS; Manufacturer: YAGEO; Tolerance: 5%; RK PN: RC0402JR-0722RL; Priority: A; Part Type: Í¨ÓÃºñÄ¤µç×è; Wattage: 1/16W; Manufacturer PN: RC0402JR-0722RL; Created by: YTL
R11 R13 = RESISTOR_Dup1: 30K +/-5% 1/16W 0402 ROHS; Manufacturer: YAGEO; Tolerance: 5%; RK PN: RC0402JR-0722RL; Priority: A; Part Type: Í¨ÓÃºñÄ¤µç×è; Wattage: 1/16W; Manufacturer PN: RC0402JR-0722RL; Created by: YTL
R14 = RESISTOR_Dup1: 52.3K +/-1% 1/16W 0402 ROHS; Manufacturer: YAGEO; Tolerance: 5%; RK PN: RC0402JR-0722RL; Priority: A; Part Type: Í¨ÓÃºñÄ¤µç×è; Wattage: 1/16W; Manufacturer PN: RC0402JR-0722RL; Created by: YTL
R15 R19 = RESISTOR_Dup1: 11.5K +/-1% 1/16W 0402 ROHS; Manufacturer: YAGEO; Tolerance: 5%; RK PN: RC0402JR-0722RL; Priority: A; Part Type: Í¨ÓÃºñÄ¤µç×è; Wattage: 1/16W; Manufacturer PN: RC0402JR-0722RL; Created by: YTL
R18 = RESISTOR_Dup1: 15K +/-1% 1/16W 0402 ROHS; Manufacturer: YAGEO; Tolerance: 5%; RK PN: RC0402JR-0722RL; Priority: A; Part Type: Í¨ÓÃºñÄ¤µç×è; Wattage: 1/16W; Manufacturer PN: RC0402JR-0722RL; Created by: YTL
R21 = RESISTOR_Dup1: 10R +/-1% 1/10W 0603 ROHS; Manufacturer: YAGEO; Tolerance: 5%; RK PN: RC0402JR-0722RL; Priority: A; Wattage: 1/16W; Part Type: Í¨ÓÃºñÄ¤µç×è; Manufacturer PN: RC0402JR-0722RL; Created by: YTL
R22 R23 = RESISTOR_Dup1: 2.2R +/-5% 1/16W 0402 ROHS; Manufacturer: YAGEO; Tolerance: 5%; RK PN: RC0402JR-0722RL; Priority: A; Part Type: Í¨ÓÃºñÄ¤µç×è; Wattage: 1/16W; Manufacturer PN: RC0402JR-0722RL; Created by: YTL
R24 R25 = RESISTOR_Dup1: 100R +/-5% 1/16W 0402 ROHS; Manufacturer: YAGEO; Tolerance: 5%; RK PN: RC0402JR-0722RL; Priority: A; Part Type: Í¨ÓÃºñÄ¤µç×è; Wattage: 1/16W; Manufacturer PN: RC0402JR-0722RL; Created by: YTL
R26 R28 = Res Semi: 2.2K +/-1% 1/16W 0402 ROHS; Value: 1K; Published: 8-Jun-2000; Revision: July-2002: Re-released for DXP Platform.; Publisher: Altium Limited
R27 = RESISTOR_Dup2: 47K +/-1% 1/16W 0402 ROHS
R31 R32 = RESISTOR_Dup1: 2.2K +/-1% 1/16W 0402 ROHS; Manufacturer: YAGEO; Tolerance: 5%; RK PN: RC0402JR-0722RL; Priority: A; Part Type: Í¨ÓÃºñÄ¤µç×è; Wattage: 1/16W; Manufacturer PN: RC0402JR-0722RL; Created by: YTL
R34 = RESISTOR_Dup1: 220R +/-1% 1/16W 0402 ROHS; Manufacturer: YAGEO; Tolerance: 5%; RK PN: RC0402JR-0722RL; Priority: A; Part Type: Í¨ÓÃºñÄ¤µç×è; Wattage: 1/16W; Manufacturer PN: RC0402JR-0722RL; Created by: YTL
R35 = RESISTOR_Dup1: 4.3K +/-1% 1/16W 0402 ROHS; Manufacturer: YAGEO; Tolerance: 5%; RK PN: RC0402JR-0722RL; Priority: A; Part Type: Í¨ÓÃºñÄ¤µç×è; Wattage: 1/16W; Manufacturer PN: RC0402JR-0722RL; Created by: YTL
R36 = RESISTOR_Dup1: 2K +/-1% 1/16W 0402 ROHS; Manufacturer: YAGEO; Tolerance: 5%; RK PN: RC0402JR-0722RL; Priority: A; Part Type: Í¨ÓÃºñÄ¤µç×è; Wattage: 1/16W; Manufacturer PN: RC0402JR-0722RL; Created by: YTL
R37 = RESISTOR_Dup1: 330R +/-5% 1/16W 0402 ROHS; Manufacturer: YAGEO; Tolerance: 5%; RK PN: RC0402JR-0722RL; Priority: A; Part Type: Í¨ÓÃºñÄ¤µç×è; Wattage: 1/16W; Manufacturer PN: RC0402JR-0722RL; Created by: YTL
R38 = RESISTOR_Dup1: 75R +/-1% 1/16W 0402 ROHS; Manufacturer: YAGEO; Tolerance: 5%; RK PN: RC0402JR-0722RL; Priority: A; Part Type: Í¨ÓÃºñÄ¤µç×è; Wattage: 1/16W; Manufacturer PN: RC0402JR-0722RL; Created by: YTL
R40 = RES: 10K +/-1% 1/16W 0402 ROHS; 名称: 贴片电阻; Parameter 1: 0R 5% 1/10W 0603 RoHS; Parameter 2: 0R 5% 1/8W 0805 RoHS; Parameter 3: 0.25R 1% 1/4W 1206 ROHS; Parameter 4: 0.25R 1% 1/2W 1812 ROHS; Parameter 5: 0R 1% 1/16W 0402 RoHS
U1 = F1C200S
U2 = HT7333
U3 = N76E003AT20: IC; 物料编号: EIC00048; 规格，型号: STM8S003F3 (TSSOP20); 名称: IC
U4 = 25Q128: StockNumber: *
U5 U8 U9 = JW5052S: JW5052S(3.7V~18V/2A  Sync. Step-Down Converter)
U6 = HT6871: NS4150 (SOIC8); 物料编号: EIC00042; 名称: IC; 规格，型号: HT6871 (SOP-8L)
U7 = PCF8563T: PCF8563T (SOP-8) OR BM8563ESA(SOP8)
U10 = AP3031_0: AP3032KTR-G1  (SOT-23-6)
U11 = RT9193-33GB: RT9193-33GB (SOT23-5)
U12 = Voltage_Regulator: ME6211A12M3G-N (SOT-23-3)
X1 = XTAL: 贴片无源晶振/SSP-T7-F 32.768kHz 20PPM 12.5p 编带; StcokNumber: *
X2 = CRYSTAL-4_0: 贴片无源晶振/YSX321SL 24MHZ 10PF 10PPM -40~+85 袋装; PART NUMBER: 7M24000004; Vendor: TXC; SPREADWIN PN: U3000019A